# Altium schematic sheet stripped.SchDoc
size A4
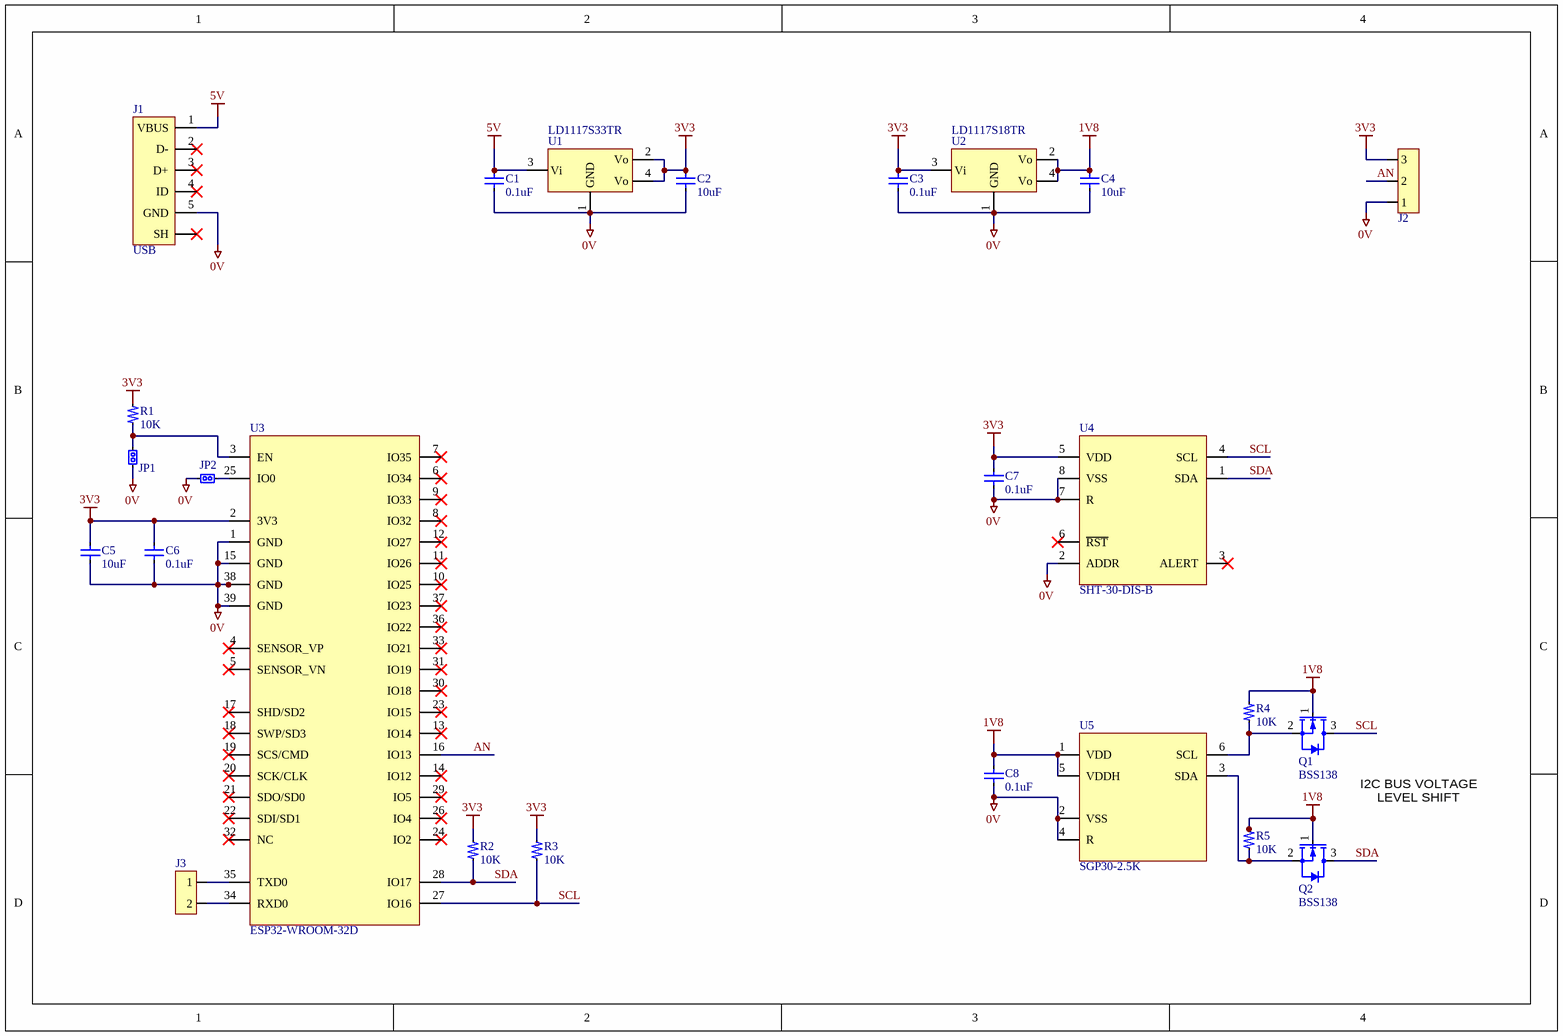
[diagram p0: stripped.SchDoc]

## Parts
C1  0.1uF  [Capacitor_0603]
C2  10uF  [Capacitor_0603]
C3  0.1uF  [Capacitor_0603]
C4  10uF  [Capacitor_0603]
C5  10uF  [Capacitor_0603]
C6  0.1uF  [Capacitor_0603]
C7  0.1uF  [Capacitor_0603]
C8  0.1uF  [Capacitor_0603]
J1  USB  [CON_uUSB_NODRILL]
J2  3pin_TH_Via_Solder_Connector  [3pin_VIA_solder_connector]  (value not drawn)  (no BOM)
J3  Con_2Pos_2.54mm_SMD  [1x2 SMD header]  (value not drawn)
JP1  0603  [pads_0603]  (value not drawn)  (no BOM)
JP2  0603  [pads_0603]  (value not drawn)  (no BOM)
Q1  BSS138  [SOT-23-3]
Q2  BSS138  [SOT-23-3]
R1  10K  [Resistor_0603]
R2  10K  [Resistor_0603]
R3  10K  [Resistor_0603]
R4  10K  [Resistor_0603]
R5  10K  [Resistor_0603]
U1  LD1117S33TR  [SOT-223]
U2  LD1117S18TR  [SOT-223]
U3  ESP32-WROOM-32D  [ESP_WROOM_32D]
U4  SHT-30-DIS-B  [SHT3x_8-VFDFN_Exposed_Pad]
U5  SGP30-2.5K  [SGP30-2.5k]

## Nets
0V: C1.1 C2.2 C3.1 C4.1 C5.1 C6.1 C7.1 C8.1 J1.5(GND) J2.1 JP1.1 JP2.1 U1.1(GND) U2.1(GND) U3.1(GND) U3.15(GND) U3.38(GND) U3.39(GND) U4.2(ADDR) U4.7(R) U4.8(VSS) U5.2(VSS) U5.4(R)
1V8: C4.2 C8.2 Q1.1(G) Q2.1(G) R4.2 R5.2 U2.2(Vo) U2.4(Vo) U5.1(VDD) U5.5(VDDH)
3V3: C2.1 C3.2 C5.2 C6.2 C7.2 J2.3 R1.2 R2.2 R3.2 U1.2(Vo) U1.4(Vo) U2.3(Vi) U3.2(3V3) U4.5(VDD)
5V: C1.2 J1.1(VBUS) U1.3(Vi)
AN: J2.2 U3.16(IO13)
SCL: Q1.3(D) R3.1 U3.27(IO16) U4.4(SCL)
SDA: Q2.3(D) R2.1 U3.28(IO17) U4.1(SDA)
NetJ3_1: J3.1 U3.35(TXD0)
NetJ3_2: J3.2 U3.34(RXD0)
NetJP1_2: JP1.2 R1.1 U3.3(EN)
NetJP2_2: JP2.2 U3.25(IO0)
NetQ1_2: Q1.2(S) R4.1 U5.6(SCL)
NetQ2_2: Q2.2(S) R5.1 U5.3(SDA)

Not connected (* = marked no-connect by the designer): J1 2(D-)* 3(D+)* 4(ID)* SH*; U3 4(SENSOR_VP)* 5(SENSOR_VN)* 6(IO34)* 7(IO35)* 8(IO32)* 9(IO33)* 10(IO25)* 11(IO26)* 12(IO27)* 13(IO14)* 14(IO12)* 17(SHD/SD2)* 18(SWP/SD3)* 19(SCS/CMD)* 20(SCK/CLK)* 21(SDO/SD0)* 22(SDI/SD1)* 23(IO15)* 24(IO2)* 26(IO4)* 29(IO5)* 30(IO18)* 31(IO19)* 32(NC)* 33(IO21)* 36(IO22)* 37(IO23)*; U4 3(ALERT)* 6(~{RST})*

## Notes on the sheet
- I2C BUS VOLTAGE LEVEL SHIFT

## Library data of the parts
C1-C8 = Capacitor: Generic capacitor symbol; Manufacturer: Murata; Manufacturer Part Number: GCM188R71C104KA37D; Tolerance: 10%; Capacitance: 100nF; Voltage Rating: 16V; Dielectric: X7R; Supplier 1: Digi-Key; Stock 1: 40000; Pricing 1: 1=0.1, 10=0.076, 100=0.0341, 500=0.0243, 1000=0.0191 (USD); Mount: Surface Mount; Case/Package: 0603; Case Code (Metric): 1608; Case Code (Imperial): 0603; Min Operating Temperature: -55°C; Max Operating Temperature: 125°C; Packaging: Tape and Reel; Package Quantity: 4000; Voltage Rating (DC): 16V; Termination: SMD/SMT; Voltage: 16V; Length: 1.6mm; Height: 0.8mm; Width: 0.031inch; Thickness: 0.035inch; Depth: 0.8mm; Ratings: AEC-Q200; Radiation Hardening: No; REACH SVHC: No SVHC; Lead Free: Lead Free; Supplier Part Number 1: 490-4774-1-ND
J1 = Con_USB_5pos+Shield_NoDrill: USB 2.0 Connector, Shielded, NoDrill
J2 = 3pin_TH_Via_Solder_Connector: NO-BOM
J3 = Con_2Pos_2.54mm_SMD: 2 position connector; Supplier 1: Digi-Key; Supplier Part Number 1: WM9852-ND
JP1 JP2 = Jumper Pad 0603: Jumper pads, 0603, no-BOM
Q1 Q2 = MFET_Nch: MOSFET N-CH 50V 220MA SOT-23; Supplier 1: Digi-Key; Supplier Part Number 1: BSS138DKR-ND
R1-R5 = Resistor: Generic resistor symbol
U1 = LDO_3V3: Fixed 3V3 output LDO LD1117S33TR; Supplier 1: Digi-Key; Supplier Part Number 1: 497-1242-1-ND
U2 = LDO_1V8: Fixed 1V8 output LDO LD1117S18TR; Supplier 1: Digi-Key; Supplier Part Number 1: 497-7308-1-ND
U3 = ESP32_WROOM: ESP32 Module; Supplier 1: Mouser; Supplier Part Number 1: 356-ESP32WROOM-32D
U4 = SHT-30: SENSOR HUMID/TEMP 5V I2C 3% SMD; Supplier 1: Digi-Key; Supplier Part Number 1: 1649-1009-1-ND
U5 = SGP-30: SENSOR AIR QUALITY 2V I2C SMD; Supplier 1: Digi-Key; Supplier Part Number 1: 1649-1084-1-ND